# EAGLE design EXTERNAL_BME280 (EAGLE 7.2.0)
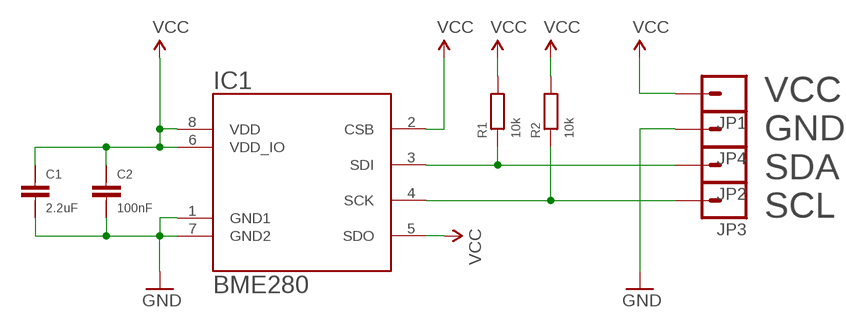
[diagram p0: schematic, sheet 1]

## Parts
C1  2.2uF  CAP-0402  [0402]
C2  100nF  CAP-0402  [0402]
IC1  BME280  [BME280]
JP1  M01SOLAR  [PAD2_1.8X0.9]
JP2  M01SOLAR  [PAD2_1.8X0.9]
JP3  M01SOLAR  [PAD2_1.8X0.9]
JP4  M01SOLAR  [PAD2_1.8X0.9]
R1  10k  RES-0402  [0402]
R2  10k  RES-0402  [0402]

## Nets
GND: C1.P$1 C2.P$1 IC1.1(GND1) IC1.7(GND2) JP4.1
N$3: IC1.3(SDI) JP2.1 R1.P$1
N$4: IC1.4(SCK) JP3.1 R2.P$1
VCC: C1.P$2 C2.P$2 IC1.2(CSB) IC1.5(SDO) IC1.6(VDD_IO) IC1.8(VDD) JP1.1 R1.P$2 R2.P$2

## Notes on the sheet
- VCC
  GND
  SDA
  SCL

## Library data of the parts
C1 C2 = sven:CAP-0402
IC1 = bme280:BME280
JP1-JP4 = sven:M01: Header 1 Standard 1-pin 0.1" header. Use with straight break away headers (SKU : PRT-00116), right angle break away headers (PRT-00553), swiss pins (PRT-00743), machine pins (PRT-00117), and female headers (PRT-00115).
R1 R2 = sven:RES-0402

## Board
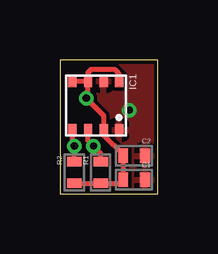
[diagram p1: board, top side]
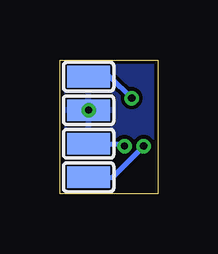
[diagram p2: board, bottom side, seen from below]

Size 4.1 x 5.6 mm. Coordinates in mm from the lower left corner, seen from the top.
Outline: 0,0 4.1,0 4.1,5.6 0,5.6 0,0
Copper layers (1*16): Top 0.035mm / dielectric 1.5mm / Bottom 0.035mm
Design rules "Hackvana": minimum track width 6mil, minimum drill 0.3mm, track to track 6mil, track to pad 6mil, pad to pad 6mil, via to via 6mil, smd to smd 0mil, copper to edge 6mil, drill to drill 6mil, minimum pad ring 10mil, minimum via ring 6mil, stop-mask expansion 2mil, vias tented up to drill 100mil, thermal gap 10mil

### Footprints (pad centres in the part's own frame; a part is rotated, then mirrored left to right if it is on the bottom)
0402 = smd 0.4 x 0.6: P$1 -0.45,0; P$2 0.45,0
BME280 = smd 0.5 x 0.35: 1 1.025,0.975; 2 1.025,0.325; 3 1.025,-0.325; 4 1.025,-0.975; 5 -1.025,-0.975; 6 -1.025,-0.325; 7 -1.025,0.325; 8 -1.025,0.975
PAD2_1.8X0.9 = smd 1.8 x 0.9: 1 0,0

### Placement (x,y rotation side)
C1  3.1,0.6 180 top
C2  3.1,1.6 180 top
IC1  1.5,3.7 270 top
JP1  2.9,4.9 0 bottom
JP2  2.9,2.1 0 bottom
JP3  2.9,0.7 0 bottom
JP4  2.9,3.5 0 bottom
R1  1.7,0.9 270 top
R2  0.6,0.9 270 top

### Tracks (layer width: path | path; a pad name or v marks a point on that pad's centre or on a via)
GND  (via drill 0.3)
  other vias: 2.9,3.5
  pour Bottom: 0,5.6 4.1,5.6 4.1,0 0,0
  pour Top: 0,5.6 4.1,5.6 4.1,0 0,0
N$3  (via drill 0.3)
  Top 0.2: R1.P$1 1.7,1.7 v1.4,2 1.18,2.23 IC1.3
  Bottom 0.2: JP2.1 1.5,2.1 v1.4,2
N$4  (via drill 0.3)
  Top 0.2: R2.P$1 v0.6,2 0.53,2.08 IC1.4
  Bottom 0.2: JP3.1 1.9,0.7 v0.6,2
VCC  (via drill 0.3)
  Top 0.2: R2.P$2 R1.P$2 2.55,0.45 C1.P$2 C2.P$2 2.65,1.65 1.82,2.48 IC1.2 | IC1.5 IC1.6 | IC1.2 1.82,2.83 | IC1.8 2.48,5.03 2.3,5.2 1.3,5.2 1.18,5.08 IC1.6 | IC1.6 1.18,4.08 v1.1,4 1.82,3.27 IC1.2
  Bottom 0.2: JP1.1 2,4.9 v1.1,4